# EasyEDA Pro project 主板.eprj

# Schematic Schematic1
Board Name: Board1; Create Date: 2024-11-16; Page Name: P1; Project Name: 主板; Schematic Name: Schematic1; Update Date: 2024-11-17; Company: 嘉立创EDA; Page Size: A4; Version: V1.0
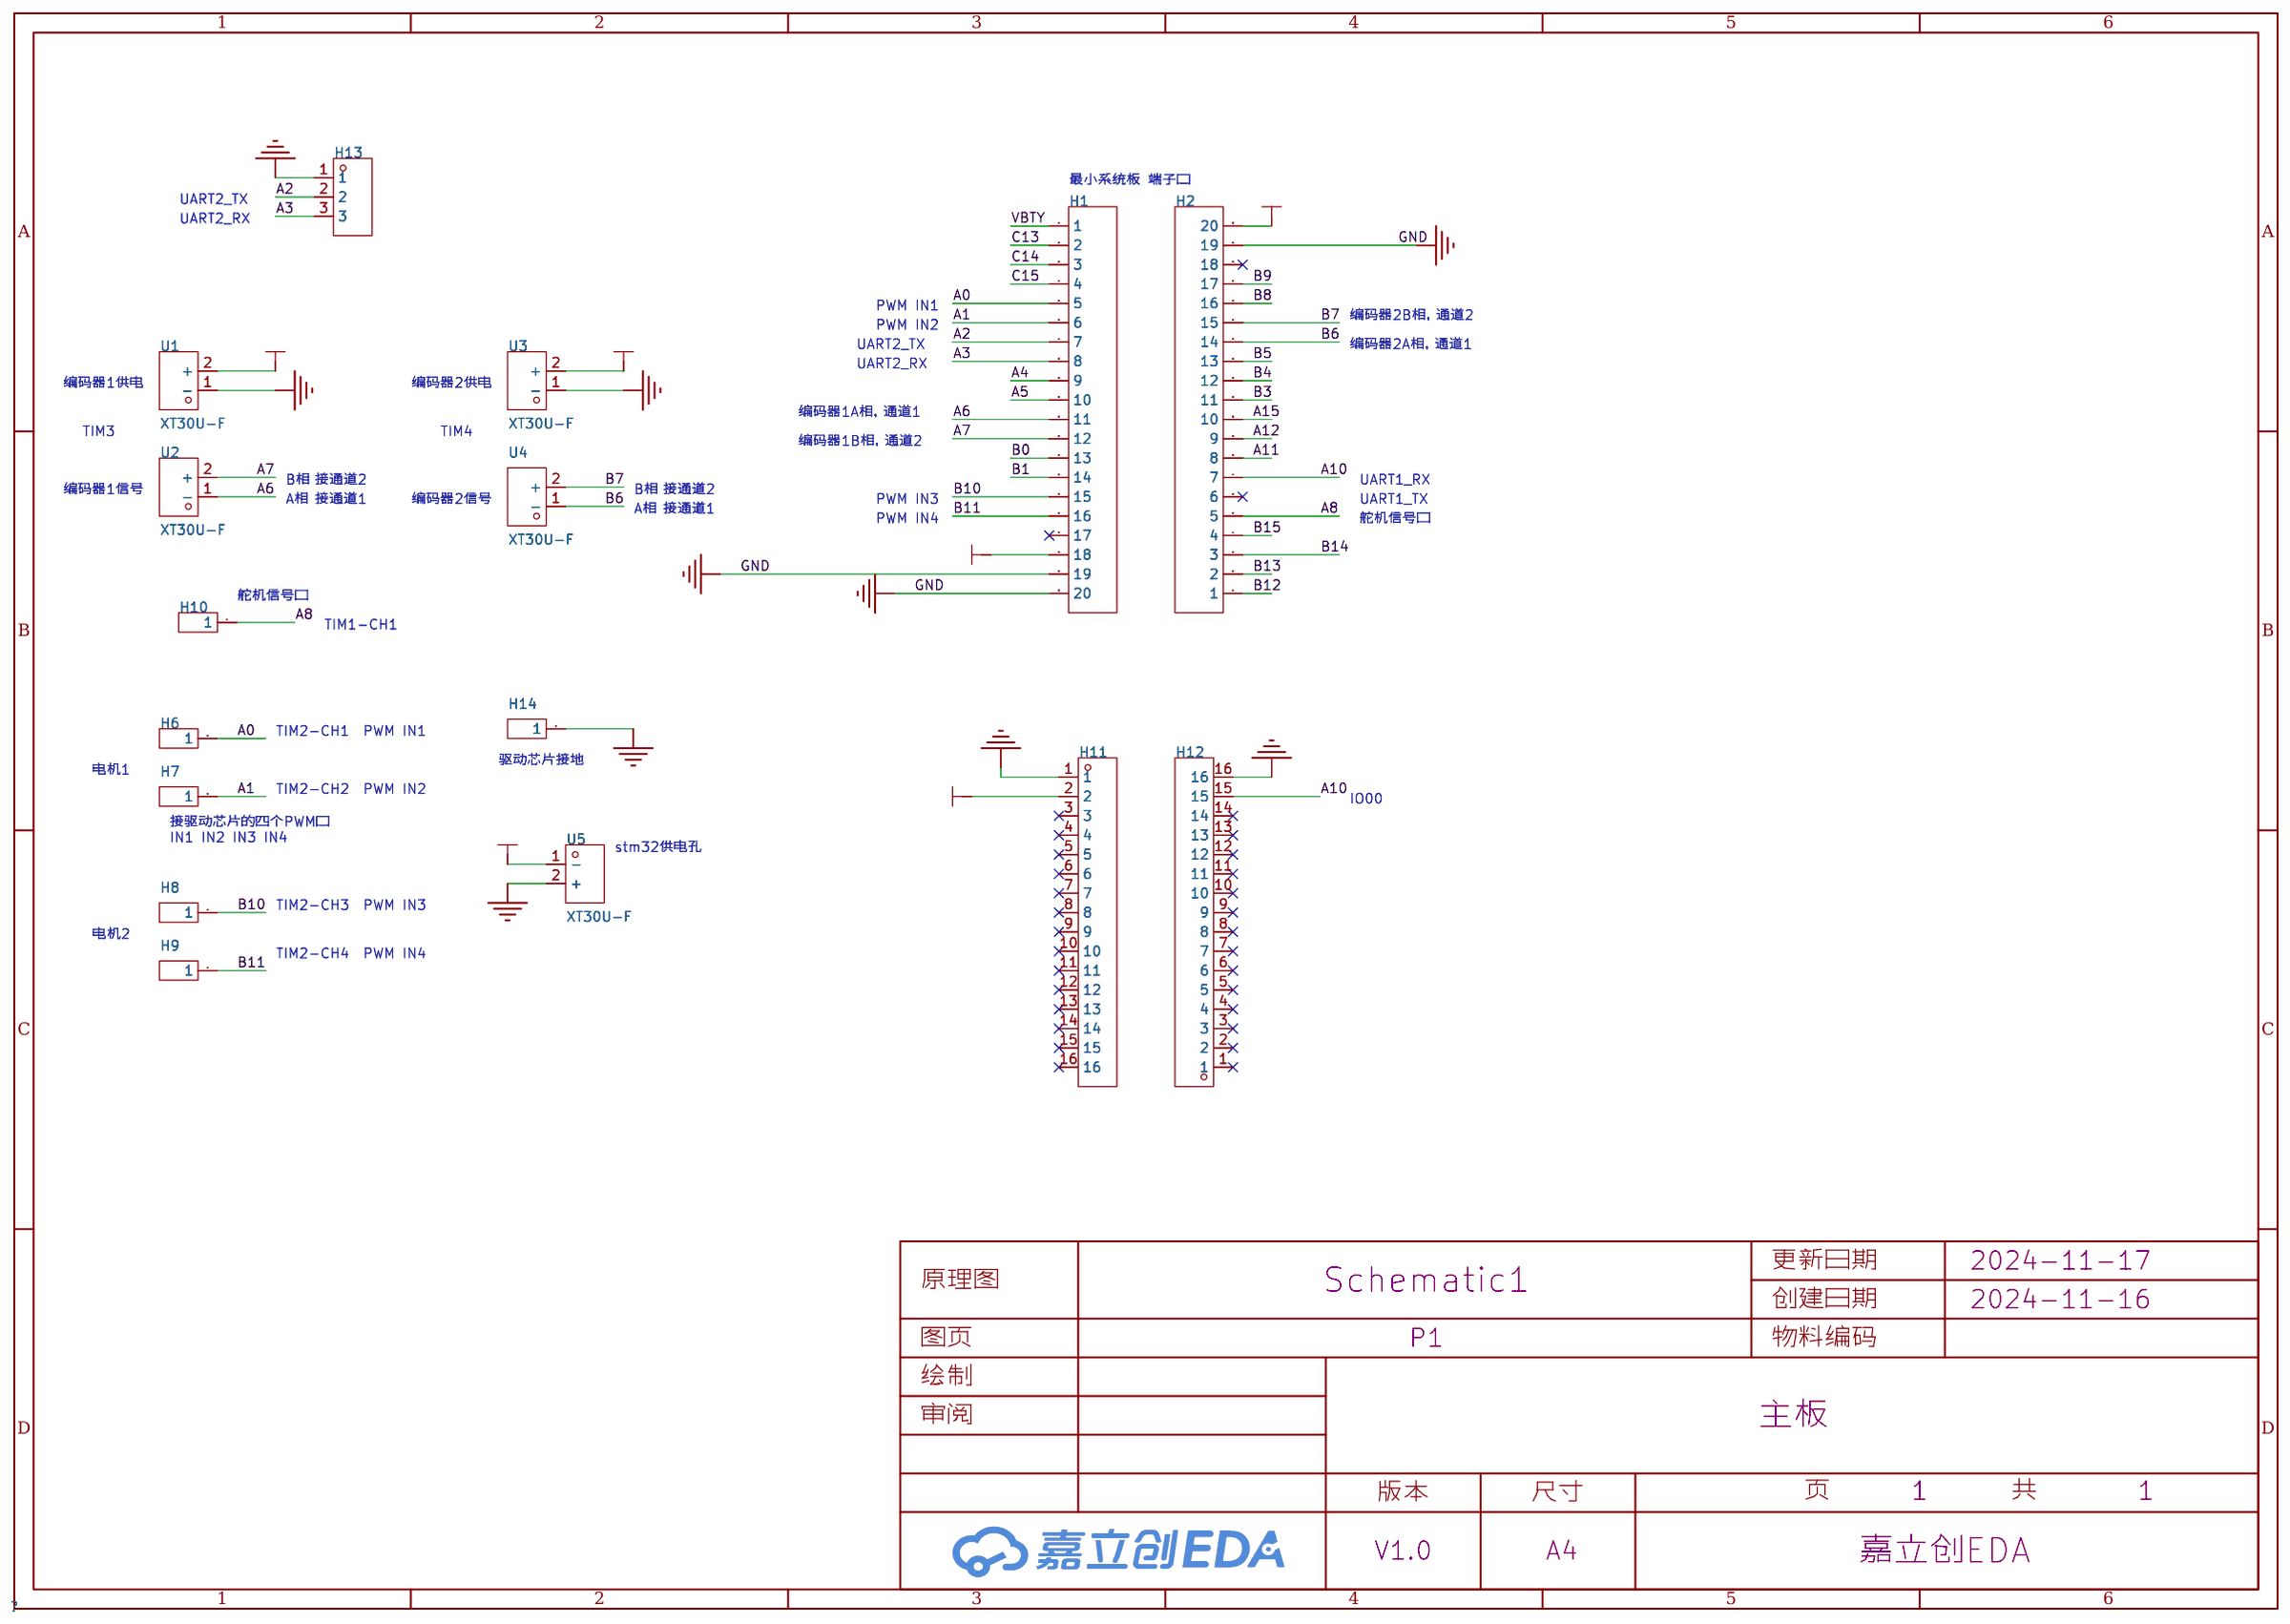
[diagram p0: schematic sheet]

## Parts
H1  -  [HDR-TH_20P-P2.54-V-F]
H2  -  [HDR-TH_20P-P2.54-V-F]
H6  -  [HDR-TH_1P-V-M_XKB_X4611WV-01I-C28D40]
H7  -  [HDR-TH_1P-V-M_XKB_X4611WV-01I-C28D40]
H8  -  [HDR-TH_1P-V-M_XKB_X4611WV-01I-C28D40]
H9  -  [HDR-TH_1P-V-M_XKB_X4611WV-01I-C28D40]
H10  -  [HDR-TH_1P-V-M_XKB_X4611WV-01I-C28D40]
H11  -  [HDR-TH_16P-P2.54-V-F-1]
H12  -  [HDR-TH_16P-P2.54-V-F-1]
H13  -  [HDR-TH_3P-P2.54-V-F]
H14  -  [HDR-TH_1P-V-M_XKB_X4611WV-01I-C28D40]
U1  XT30U-F  [CONN-TH_XT30U-F]
U2  XT30U-F  [CONN-TH_XT30U-F]
U3  XT30U-F  [CONN-TH_XT30U-F]
U4  XT30U-F  [CONN-TH_XT30U-F]
U5  XT30U-F  [CONN-TH_XT30U-F]

## Library data of the parts
H1 H2 = HDR-F_2.54_1x20P: Supplier Part: C50984; Supplier Footprint: 插件
H6-H10 H14 = HDR-M_2.54_1x1P: Supplier Part: C81276; Supplier Footprint: 插件; JLCPCB Part Class: Extended Part
H11 H12 = HDR-F_2.54_1x16P: Supplier Part: C124409; Supplier Footprint: 插件
H13 = HDR-F_2.54_1x3P: Supplier Part: C541850; Supplier Footprint: 插件
U1-U5 = XT30U-F: LCSC Part Name: AMASS(艾迈斯)轻量版锂电池插头母头 XT30U-F; Supplier Part: C99102; Manufacturer: AMASS(艾迈斯); JLCPCB Part Class: Extended Part; Datasheet: https://atta.szlcsc.com/upload/public/pdf/source/20190916/C428721_B0ECB8C5937139CEFE8736D2D3175B0E.pdf; Supplier: LCSC; Brand: 艾迈斯; Type: 插头; Colour: 黄色; InterfaceType: 母头

## Nets
3V3: H2.20 H11.2 U1.2(+) U3.2(+)
3V31: H1.18 U5.1(-)
GND: H1.19 H1.20 H2.19 H11.1 H12.16 H13.1 H14.1 U1.1(-) U3.1(-) U5.2(+)
A0: H1.5 H6.1
A1: H1.6 H7.1
A2: H1.7 H13.2
A3: H1.8 H13.3
A4: H1.9
A5: H1.10
A6: H1.11 U2.1(-)
A7: H1.12 U2.2(+)
A8: H2.5 H10.1
A10: H2.7 H12.15
A11: H2.8
A12: H2.9
A15: H2.10
B0: H1.13
B1: H1.14
B3: H2.11
B4: H2.12
B5: H2.13
B6: H2.14 U4.1(-)
B7: H2.15 U4.2(+)
B8: H2.16
B9: H2.17
B10: H1.15 H8.1
B11: H1.16 H9.1
B12: H2.1
B13: H2.2
B14: H2.3
B15: H2.4
C13: H1.2
C14: H1.3
C15: H1.4
VBTY: H1.1

Not connected (* = marked no-connect by the designer): H1 17*; H2 6* 18*; H11 3* 4* 5* 6* 7* 8* 9* 10* 11* 12* 13* 14* 15* 16*; H12 1* 2* 3* 4* 5* 6* 7* 8* 9* 10* 11* 12* 13* 14*

## Notes on the sheet
- UART2_TX
- 最小系统板 端子口
- UART2_RX
- PWM IN1
- PWM IN2
- 编码器2B相，通道2
- UART2_TX
- 编码器2A相，通道1
- UART2_RX
- 编码器1供电
- 编码器2供电
- 编码器1A相，通道1
- TIM3
- TIM4
- 编码器1B相，通道2
- 编码器1信号
- B相
- 接通道2
- B相
- 接通道2
- UART1_RX
- A相
- 接通道1
- 编码器2信号
- A相
- 接通道1
- PWM IN3
- PWM IN4
- UART1_TX
- 舵机信号口
- 舵机信号口
- TIM1-CH1
- TIM2-CH1
- PWM IN1
- 电机1
- 驱动芯片接地
- TIM2-CH2
- PWM IN2
- IO00
- 接驱动芯片的四个PWM口
  IN1 IN2 IN3 IN4
- stm32供电孔
- TIM2-CH3
- PWM IN3
- 电机2
- TIM2-CH4
- PWM IN4

# Board PCB1
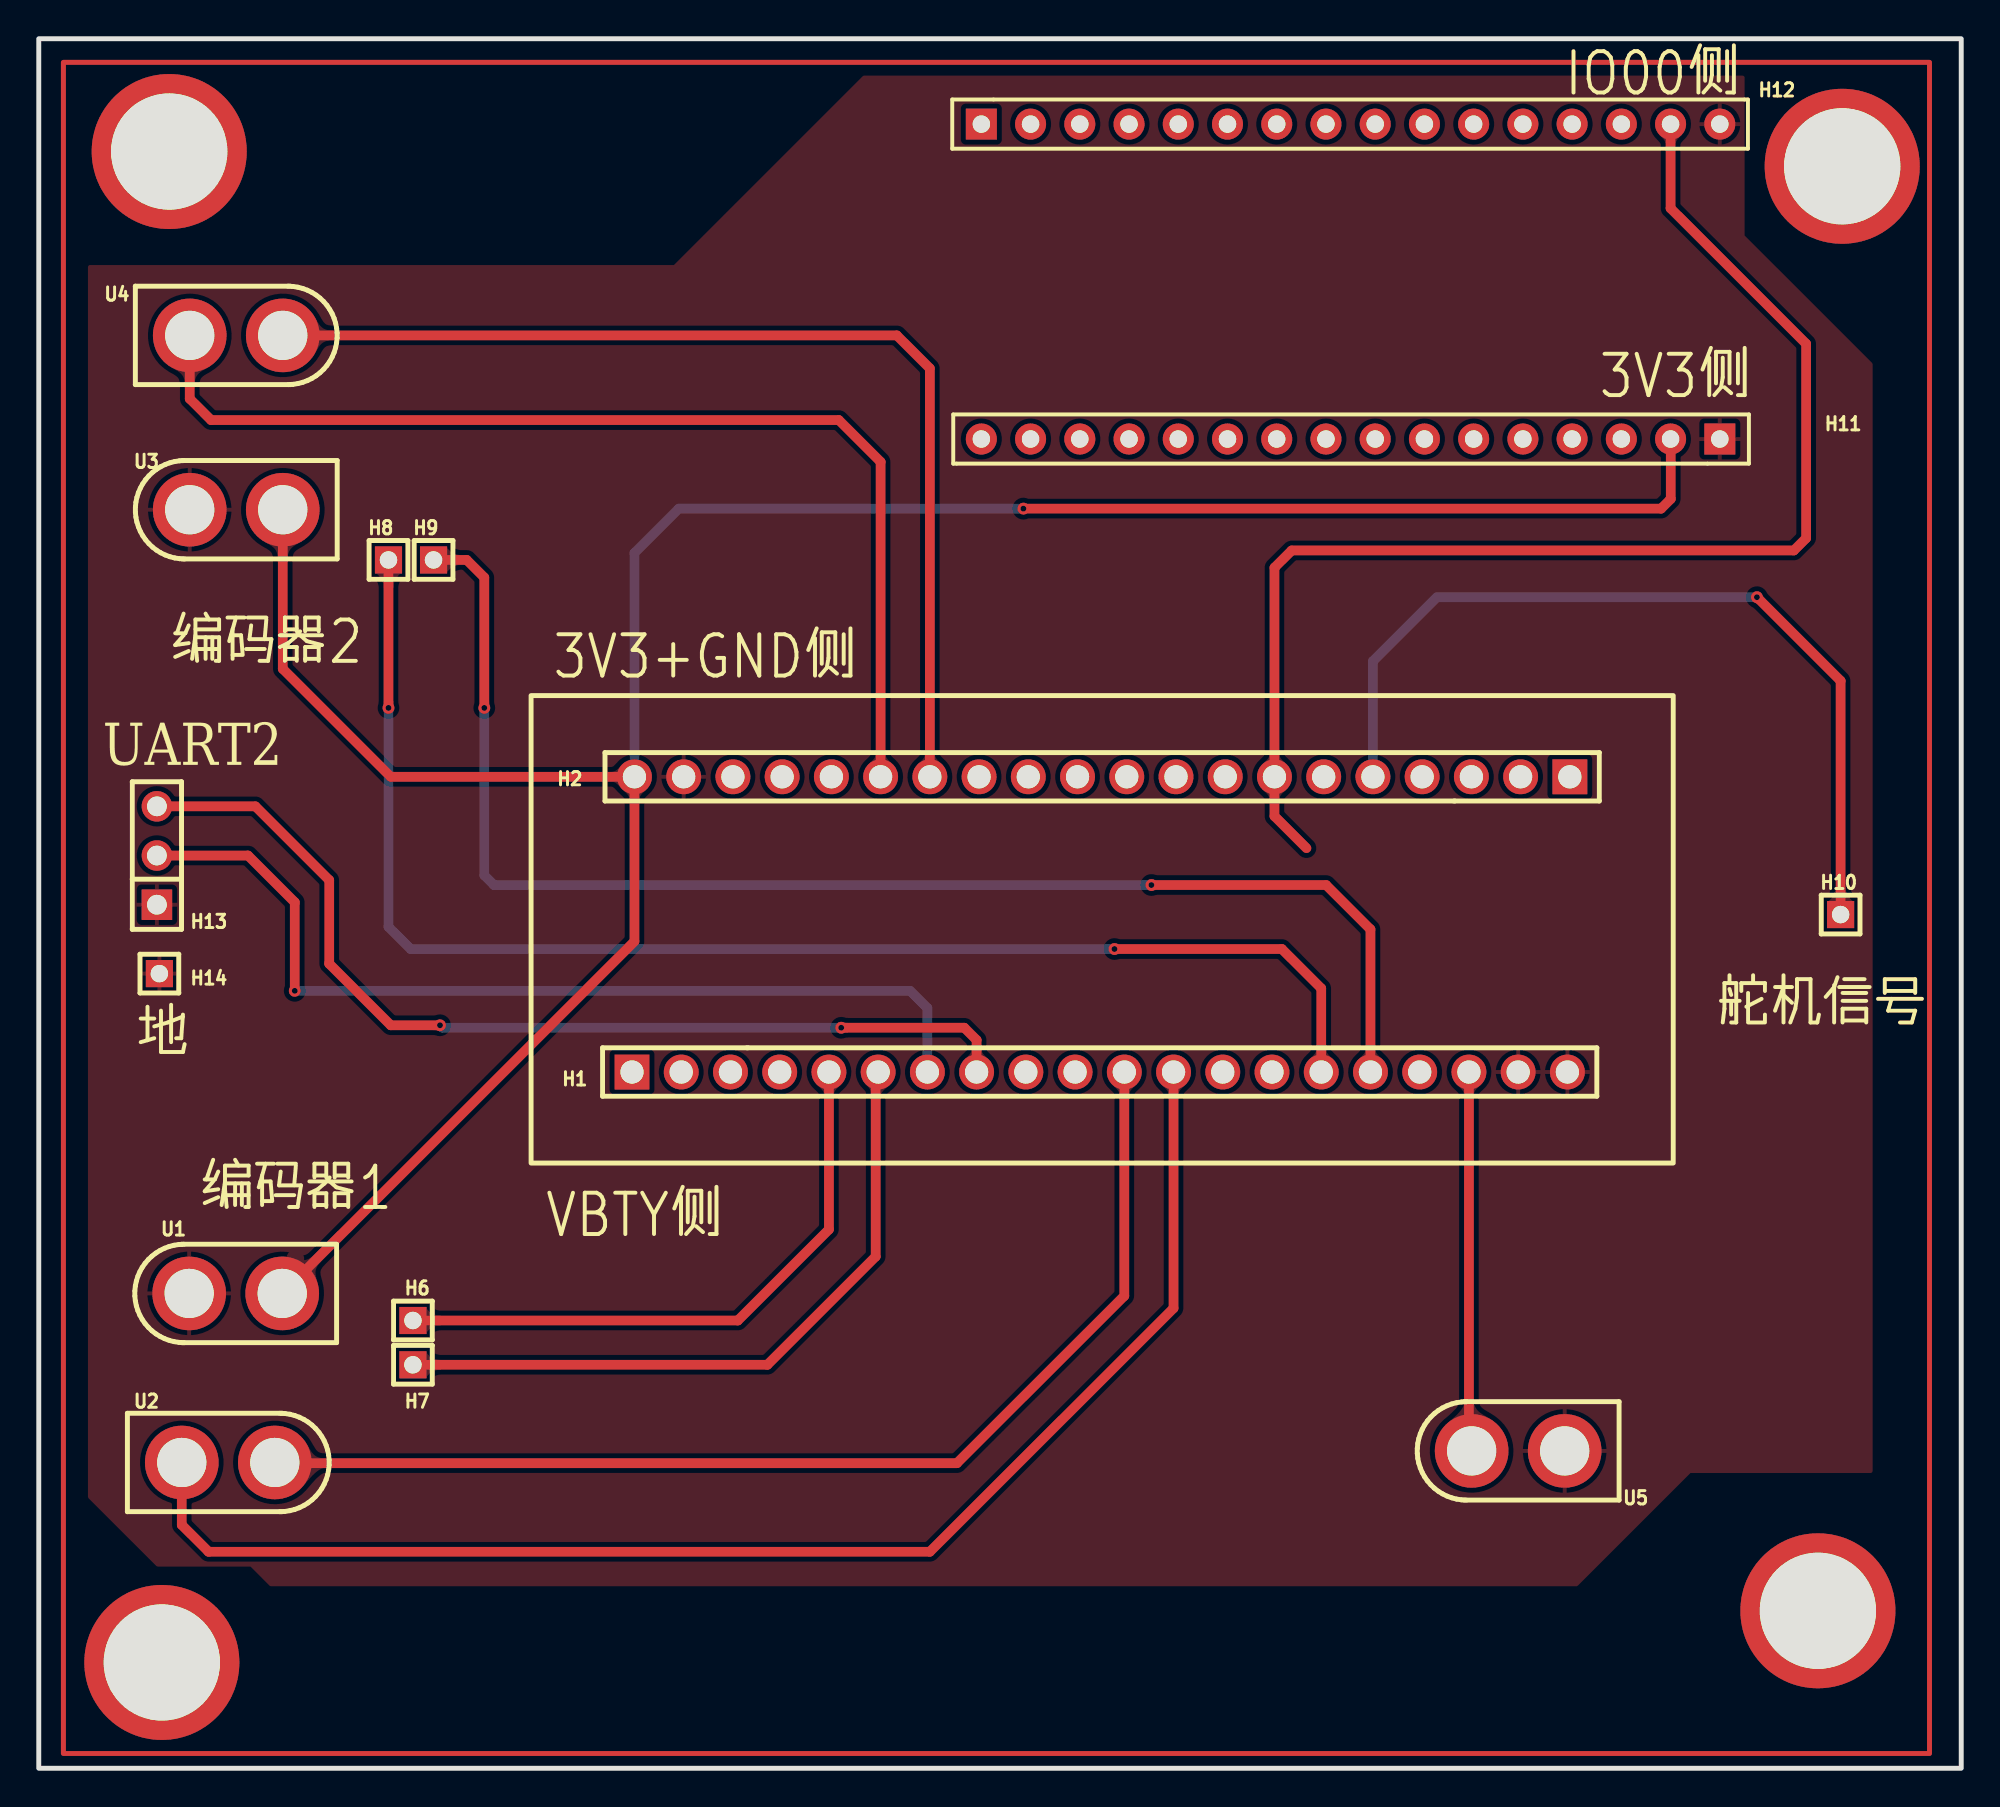
[diagram p1: board, top side]
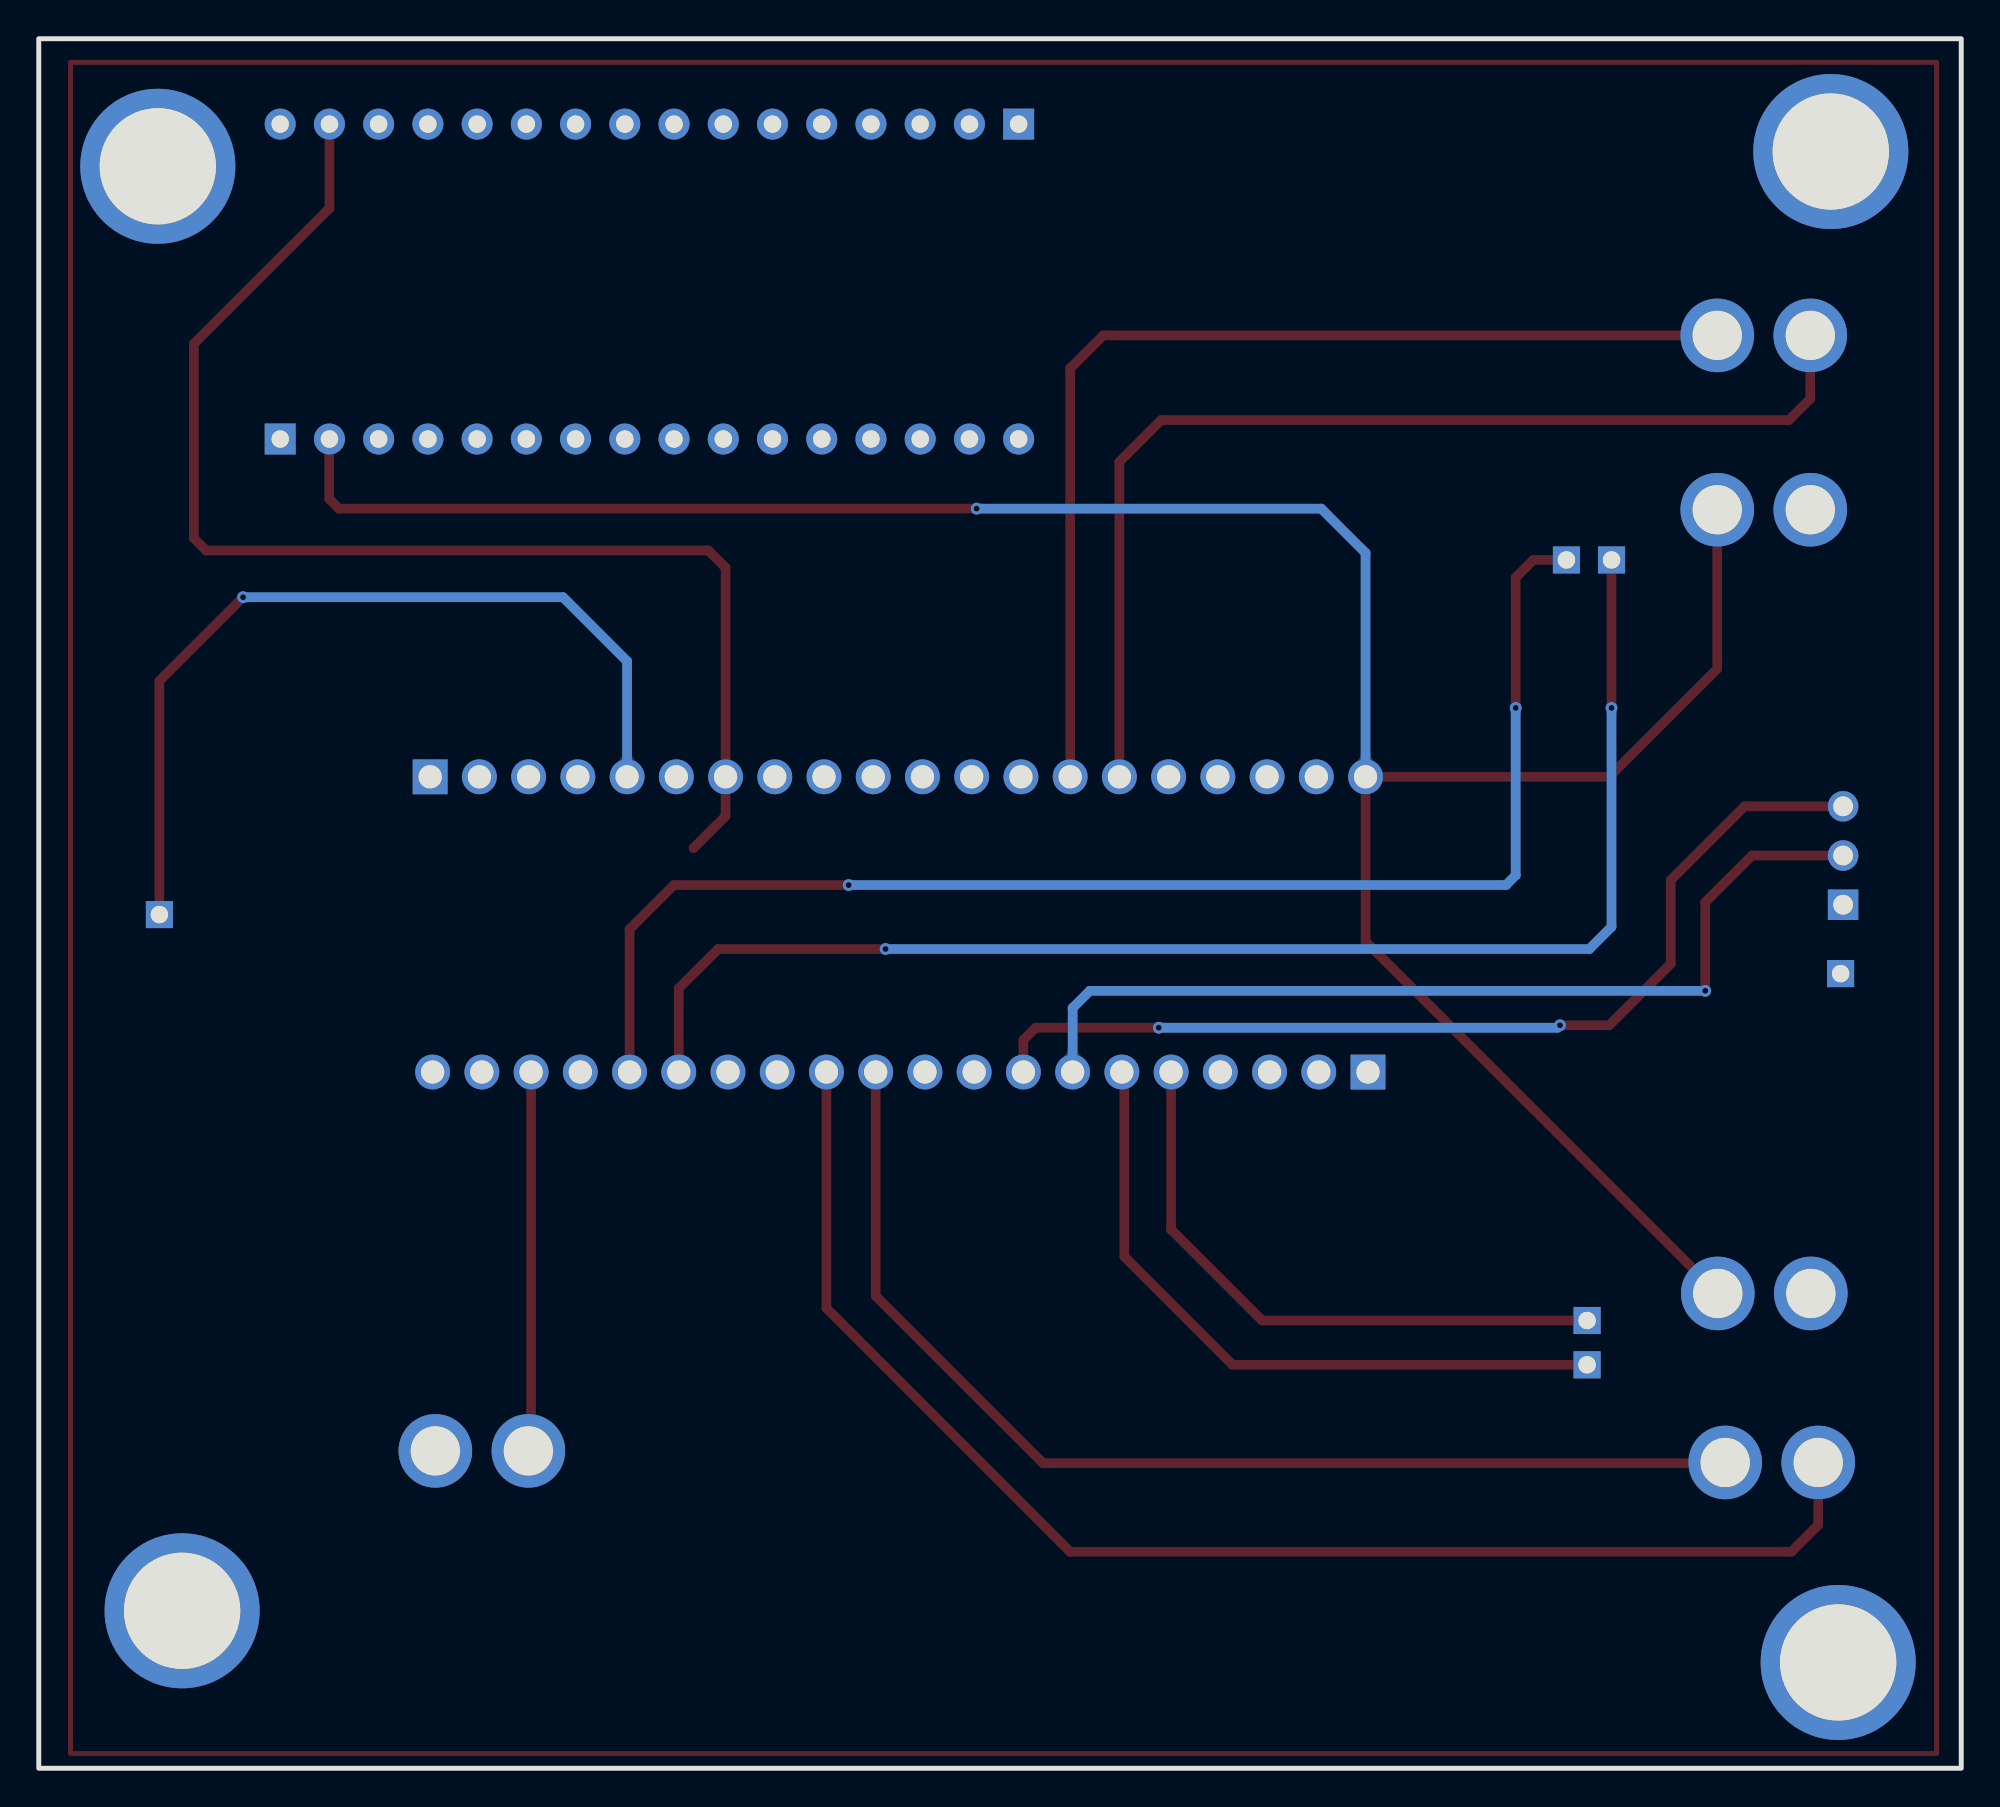
[diagram p2: board, bottom side, seen from below]

Outline 99.19 x 89.28 mm; copper layers: Top Layer, Bottom Layer. Coordinates in mm from the lower left corner of the outline.
Outline path: rectangle 0,89.28 99.19,0
Stack: Top Layer 0.035mm / Dielectric1 1.51mm FR4 er 4.5 / Bottom Layer 0.035mm

## Design rules (mm)
template: 自定义配置
spacing copperThickness1oz (default): track to track 0.102, other pairs 0.152 to 0.3
spacing copperThickness2oz: track to track 0.203, other pairs 0.152 to 0.3
track width copperThickness1oz (default): min 0.127, default 0.5, max 2.54
track width copperThickness2oz: min 0.203, default 0.254, max 2.54
differential pair differentialPair (default): width min 0.127, default 0.254, max 2.54; gap min 0.152, default 0.152
via viaSize (default): diameter min 0.5, default 0.61, max 10; hole min 0.3, default 0.305, max 6.3

## Placement (name value [footprint] x y rotation side)
H1  -  [HDR-TH_20P-P2.54-V-F]  54.74 35.94 0 top
H2  -  [HDR-TH_20P-P2.54-V-F]  54.86 51.18 180 top
H6  -  [HDR-TH_1P-V-M_XKB_X4611WV-01I-C28D40]  19.3 23.11 270 top
H7  -  [HDR-TH_1P-V-M_XKB_X4611WV-01I-C28D40]  19.3 20.83 270 top
H8  -  [HDR-TH_1P-V-M_XKB_X4611WV-01I-C28D40]  18.04 62.38 0 top
H9  -  [HDR-TH_1P-V-M_XKB_X4611WV-01I-C28D40]  20.37 62.38 0 top
H10  -  [HDR-TH_1P-V-M_XKB_X4611WV-01I-C28D40]  92.96 44.07 0 top
H11  -  [HDR-TH_16P-P2.54-V-F-1]  67.68 68.62 180 top
H12  -  [HDR-TH_16P-P2.54-V-F-1]  67.68 84.87 0 top
H13  -  [HDR-TH_3P-P2.54-V-F]  6.1 47.12 90 top
H14  -  [HDR-TH_1P-V-M_XKB_X4611WV-01I-C28D40]  6.22 41.02 0 top
NOREF  -  [Pad_e270]  6.35 5.46 0 top
NOREF#2  -  [Pad_e269]  93.05 82.7 0 top
NOREF#3  -  [Pad_e267]  6.73 83.46 0 top
NOREF#4  -  [Pad_e271]  91.79 8.13 0 top
U1  XT30U-F  [CONN-TH_XT30U-F]  10.16 24.51 180 top
U2  XT30U-F  [CONN-TH_XT30U-F]  9.78 15.79 0 top
U3  XT30U-F  [CONN-TH_XT30U-F]  10.19 64.97 180 top
U4  XT30U-F  [CONN-TH_XT30U-F]  10.19 73.97 0 top
U5  XT30U-F  [CONN-TH_XT30U-F]  76.33 16.38 180 top

## Footprints (pads in the part's own frame, mm; a bottom-side part is the same pattern mirrored in y, then rotated)
CONN-TH_XT30U-F
  round 3.8 hole 2.54: 1(2.4,0) 2(-2.4,0)
HDR-TH_1P-V-M_XKB_X4611WV-01I-C28D40
  rect 1.4x1.4 hole 0.9: 1(0,0)
HDR-TH_3P-P2.54-V-F
  rect 1.575x1.575 hole 1.02: 1(-2.54,0)
  round 1.575 hole 1.02: 2(0,0) 3(2.54,0)
HDR-TH_16P-P2.54-V-F-1
  rect 1.6x1.6 hole 0.9: 1(-19.05,0)
  round 1.6 hole 0.9: 2(-16.51,0) 3(-13.97,0) 4(-11.43,0) 5(-8.89,0) 6(-6.35,0) 7(-3.81,0) 8(-1.27,0) 9(1.27,0) 10(3.81,0) 11(6.35,0) 12(8.89,0) 13(11.43,0) 14(13.97,0) 15(16.51,0) 16(19.05,0)
HDR-TH_20P-P2.54-V-F
  rect 1.8x1.8 hole 1.2: 1(-24.13,0)
  round 1.8 hole 1.2: 2(-21.59,0) 3(-19.05,0) 4(-16.51,0) 5(-13.97,0) 6(-11.43,0) 7(-8.89,0) 8(-6.35,0) 9(-3.81,0) 10(-1.27,0) 11(1.27,0) 12(3.81,0) 13(6.35,0) 14(8.89,0) 15(11.43,0) 16(13.97,0) 17(16.51,0) 18(19.05,0) 19(21.59,0) 20(24.13,0)
Pad_e267
  round 8 hole 6: 1(0,0)
Pad_e269
  round 8 hole 6: 1(0,0)
Pad_e270
  round 8 hole 6: 1(0,0)
Pad_e271
  round 8 hole 6: 1(0,0)

## Nets
As in the schematic.

Pads without a net: H1 17; H2 6 18; H11 3 4 5 6 7 8 9 10 11 12 13 14 15 16; H12 1 2 3 4 5 6 7 8 9 10 11 12 13 14; NOREF 1; NOREF#2 1; NOREF#3 1; NOREF#4 1

## Via types
v1: diameter 0.61, hole 0.305, Top Layer to Bottom Layer, 9 vias

## Routing (per net, layer and track width the routed paths; a pad name or vN(x,y) marks a point on that pad's centre or on a via; arc(x,y) is an arc through that point)
3V3: length 132.1
  Top Layer w0.5: 84.2,68.62 84.2,65.52 83.7,65.02 v1(50.8,65.02) ; U3.2 12.59,56.75 18.16,51.18 30.73,51.18 30.73,42.69 U1.2
  Bottom Layer w0.5: v1(50.8,65.02) 33.02,65.02 30.73,62.74 30.73,51.18
3V31: length 19.6
  Top Layer w0.5: H1.18 73.79,16.52 U5.1
A0: length 31.5
  Top Layer w0.5: H6.1 36.07,23.11 40.77,27.81 H1.5
A1: length 35.8
  Top Layer w0.5: H1.6 43.18,35.81 43.18,26.42 37.59,20.83 H7.1
A2: length 49
  Top Layer w0.5: v1(13.21,40.13) 13.21,44.7 10.79,47.12 H13.2
  Bottom Layer w0.5: v1(13.21,40.13) 44.96,40.13 45.85,39.24 H1.7
A3: length 51.5
  Top Layer w0.5: H1.8 48.39,37.59 47.75,38.23 v1(41.4,38.23) ; v1(20.7,38.35) 18.16,38.35 14.99,41.53 14.99,45.85 11.18,49.66 H13.3
  Bottom Layer w0.5: v1(41.4,38.23) 20.83,38.23 v1(20.7,38.35)
A6: length 59
  Top Layer w0.5: H1.11 56.01,24.38 47.37,15.75 12.22,15.75 U2.1
A7: length 72.4
  Top Layer w0.5: H1.12 58.55,23.75 45.97,11.18 8.76,11.18 7.38,12.56 U2.2
A8: length 45.3
  Top Layer w0.5: v1(88.65,60.45) 92.96,56.13 H10.1
  Bottom Layer w0.5: H2.5 68.83,57.15 72.14,60.45 v1(88.65,60.45)
A10: length 67.5
  Top Layer w0.5: 65.41,47.5 63.75,49.15 H2.7 63.75,61.98 64.64,62.87 90.55,62.87 91.19,63.5 91.19,73.53 84.19,80.53 H12.15
B6: length 55.2
  Top Layer w0.5: U4.1 44.27,73.97 45.97,72.26 45.97,51.18
B7: length 56.5
  Top Layer w0.5: H2.15 43.43,67.44 41.28,69.6 8.89,69.6 7.79,70.7 U4.2
B10: length 72.7
  Top Layer w0.5: v1(55.5,42.29) 64.13,42.29 66.17,40.26 H1.15 ; H8.1 v1(18.04,54.74)
  Bottom Layer w0.5: v1(18.04,54.74) 18.04,43.43 19.19,42.29 v1(55.5,42.29)
B11: length 72.6
  Top Layer w0.5: v1(22.99,54.74) 22.99,61.47 22.08,62.38 H9.1 ; v1(57.4,45.59) 66.42,45.59 68.71,43.31 H1.16
  Bottom Layer w0.5: v1(22.99,54.74) 22.99,46.09 23.49,45.59 v1(57.4,45.59)

## Copper pours and planes (outline as drawn; the poured copper is in the pictures)
GND on Top Layer: 88.01,87.38 88.01,79.12 94.61,72.52 94.61,15.24 85.22,15.24 79.38,9.4 11.94,9.4 10.92,10.41 6.1,10.41 2.54,13.97 2.54,77.6 32.77,77.6 42.54,87.38

Small or netless copper shapes (teardrops, artwork), in the pictures only: 33 on Top Layer, 12 on Bottom Layer

## Text on the board
Top Silkscreen Layer: UART2 | 地 | 编码器2 | 编码器1 | VBTY侧 | 3V3+GND侧 | 舵机信号 | 3V3侧 | IO00侧
